# EAGLE design usb-hub-v0.2 (EAGLE 6.4)
CNAME: USB Power hub x4; CREVISION: V0.2; DESIGNER: kennethlimcp
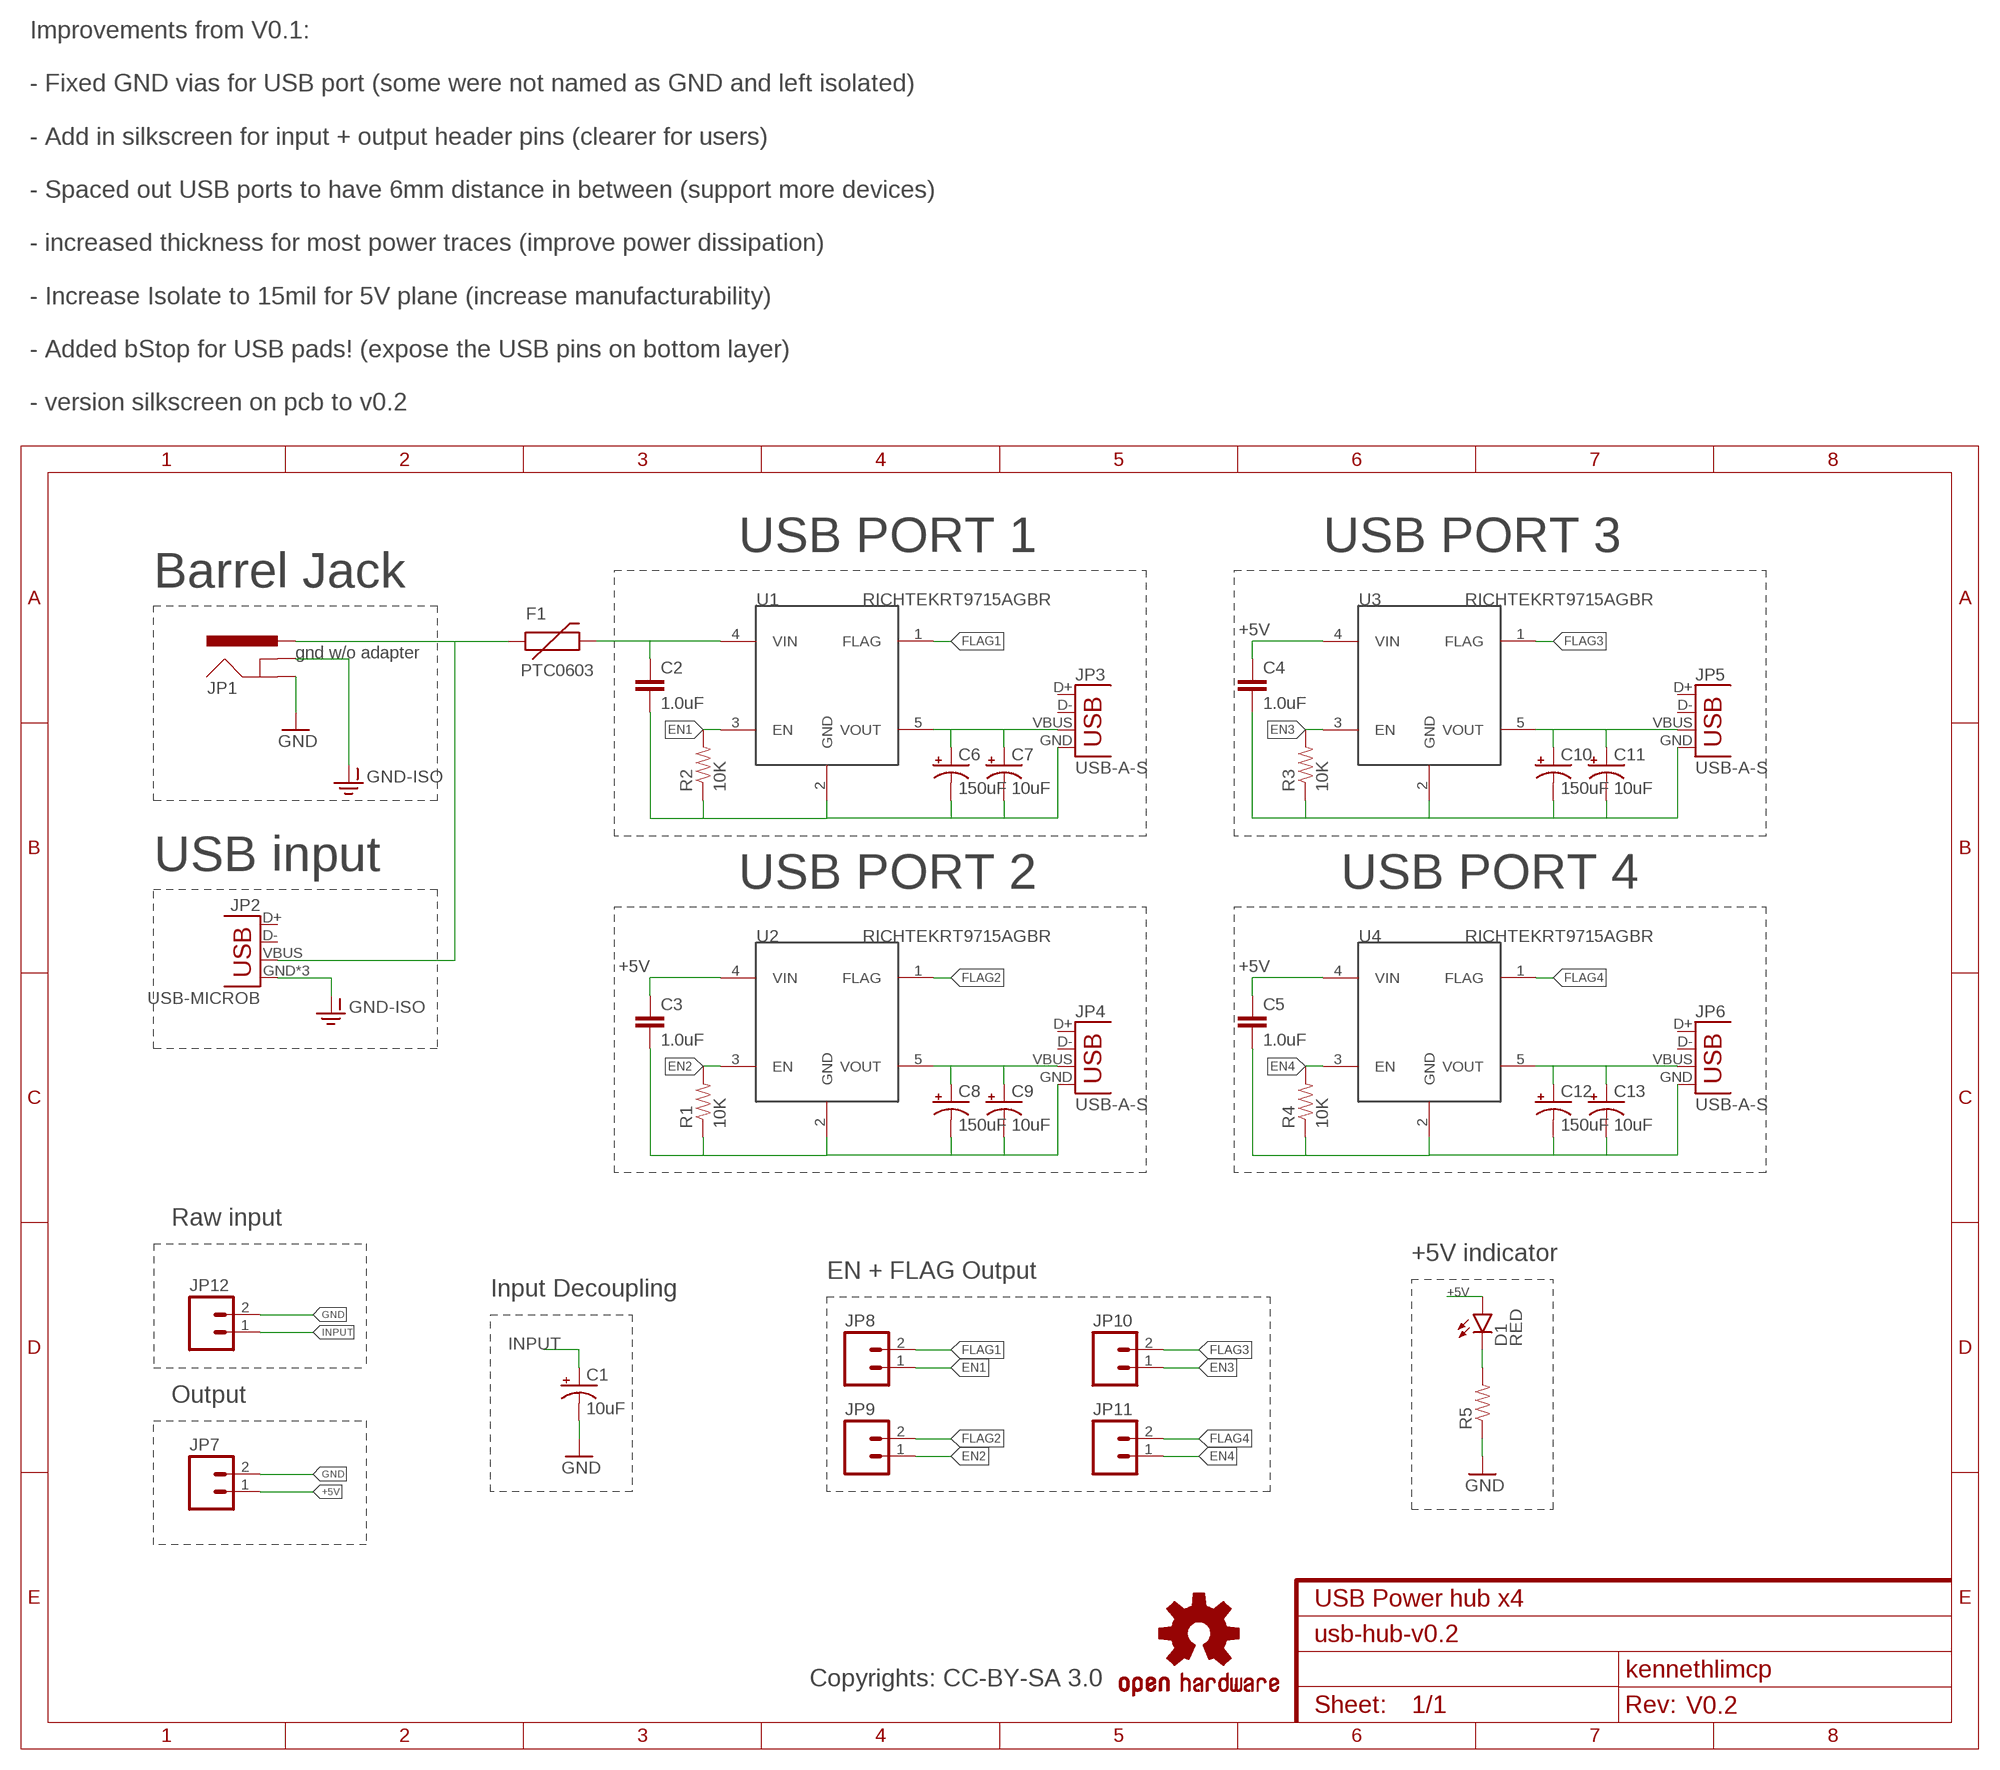
[diagram p0: schematic, sheet 1]

## Parts
C1  10uF  10UF-16V-10%(TANT)  [EIA3216]
C2  1.0uF  1.0UF-16V-10%(0603)  [0603-CAP]
C3  1.0uF  1.0UF-16V-10%(0603)  [0603-CAP]
C4  1.0uF  1.0UF-16V-10%(0603)  [0603-CAP]
C5  1.0uF  1.0UF-16V-10%(0603)  [0603-CAP]
C6  150uF  CAP_POLD  [PANASONIC_D]
C7  10uF  10UF-16V-10%(TANT)  [EIA3216]
C8  150uF  CAP_POLD  [PANASONIC_D]
C9  10uF  10UF-16V-10%(TANT)  [EIA3216]
C10  150uF  CAP_POLD  [PANASONIC_D]
C11  10uF  10UF-16V-10%(TANT)  [EIA3216]
C12  150uF  CAP_POLD  [PANASONIC_D]
C13  10uF  10UF-16V-10%(TANT)  [EIA3216]
D1  RED  LED-RED0603  [LED-0603]
F1  PTC0603  [0603]
JP1  POWER_JACKPTH_LOCK  [POWER_JACK_PTH_LOCK]
JP2  USB-MICROB  [USB-MICROB]
JP3  USB-A-S  [USB-A-S]
JP4  USB-A-S  [USB-A-S]
JP5  USB-A-S  [USB-A-S]
JP6  USB-A-S  [USB-A-S]
JP7  M02PTH  [1X02]
JP8  M02PTH  [1X02]
JP9  M02PTH  [1X02]
JP10  M02PTH  [1X02]
JP11  M02PTH  [1X02]
JP12  M02PTH  [1X02]
LOGO1  OSHW-LOGOPAD  [OSHW-LOGO-M-PAD]
R1  10K  RESISTOR0402  [0402-RES]
R2  10K  RESISTOR0402  [0402-RES]
R3  10K  RESISTOR0402  [0402-RES]
R4  10K  RESISTOR0402  [0402-RES]
R5  RESISTOR0402  [0402-RES]
U1  RICHTEKRT9715AGBR  [SOT23-5]
U2  RICHTEKRT9715AGBR  [SOT23-5]
U3  RICHTEKRT9715AGBR  [SOT23-5]
U4  RICHTEKRT9715AGBR  [SOT23-5]

## Nets
+5V: C2.1 C3.1 C4.1 C5.1 D1.A F1.2 JP7.1 U1.4(VIN) U2.4(VIN) U3.4(VIN) U4.4(VIN)
EN1: JP8.1 R2.2 U1.3(EN)
EN2: JP9.1 R1.2 U2.3(EN)
EN3: JP10.1 R3.2 U3.3(EN)
EN4: JP11.1 R4.2 U4.3(EN)
FLAG1: JP8.2 U1.1(FLAG)
FLAG2: JP9.2 U2.1(FLAG)
FLAG3: JP10.2 U3.1(FLAG)
FLAG4: JP11.2 U4.1(FLAG)
GND: C1.C(-) C2.2 C3.2 C4.2 C5.2 C6.- C7.C(-) C8.- C9.C(-) C10.- C11.C(-) C12.- C13.C(-) JP1.GND JP3.GND JP4.GND JP5.GND JP6.GND JP7.2 JP12.2 R1.1 R2.1 R3.1 R4.1 R5.1 U1.2(GND) U2.2(GND) U3.2(GND) U4.2(GND)
GND-ISO: JP1.GNDBREAK JP2.GND JP2.MT1(GND) JP2.MT2(GND)
INPUT: C1.A(+) F1.1 JP1.PWR JP2.VBUS JP12.1
N$5: D1.C R5.2
VOUT1: C6.+ C7.A(+) JP3.VBUS U1.5(VOUT)
VOUT2: C8.+ C9.A(+) JP4.VBUS U2.5(VOUT)
VOUT3: C10.+ C11.A(+) JP5.VBUS U3.5(VOUT)
VOUT4: C12.+ C13.A(+) JP6.VBUS U4.5(VOUT)
Unconnected: JP2.D+ JP2.D- JP3.D+ JP3.D- JP4.D+ JP4.D- JP5.D+ JP5.D- JP6.D+ JP6.D-

## Notes on the sheet
- Improvements from V0.1:
  
  - Fixed GND vias for USB port (some were not named as GND and left isolated)
  
  - Add in silkscreen for input + output header pins (clearer for users)
  
  - Spaced out USB ports to have 6mm distance in between (support more devices)
  
  - increased thickness for most power traces (improve power dissipation)
  
  - Increase Isolate to 15mil for 5V plane (increase manufacturability)
  
  - Added bStop for USB pads! (expose the USB pins on bottom layer)
  
  - version silkscreen on pcb to v0.2
- USB PORT 1 | USB PORT 3
- Barrel Jack
- gnd w/o adapter
- USB input
- USB PORT 2 | USB PORT 4
- Raw input
- +5V indicator
- EN + FLAG Output
- Input Decoupling
- Output
- Copyrights: CC-BY-SA 3.0

## Library data of the parts
C1 C7 C9 C11 C13 = SparkFun-Capacitors:10UF-16V-10%(TANT): CAP-00811 1206/EIA-3216 Tantalum capacitor; PROD_ID: CAP-00811
C2-C5 = SparkFun-Capacitors:1.0UF-16V-10%(0603): CAP-00868; PROD_ID: CAP-00868
C6 C8 C10 C12 = SparkFun-Capacitors:CAP_POL: Capacitor Polarized These are standard SMD and PTH capacitors. Normally 10uF, 47uF, and 100uF in electrolytic and tantalum varieties. Always verify the external diameter of the through hole cap, it varies with capacity, voltage, and manufacturer. The EIA devices should be standard.
D1 = SparkFun-LED:LED-RED: Assorted Red LEDs LilyPad 1206- DIO-09912 1206- DIO-00809 0603- DIO-00819; PROD_ID: DIO-00819
F1 = SparkFun-PowerIC:PTC: Resettable Fuse PTC Resettable Fuse. Spark Fun Electronics SKU : COM-08357
JP1 = SparkFun-Connectors:POWER_JACK: Power Jack This is the standard 5.5mm barrel jack for power. The PTH is the most common, proven, reliable, footprint. The Slot footprint only works if the mill layer is transmitted to the PCB fab house so be warned. Mating wall wart : TOL-00298 (and others); PROD_ID: CONN-08197; SF_ID: PRT-00119
JP2 = SparkFun-Connectors:USB: USB Connectors USB-B-PTH is fully proven SKU : PRT-00139/CONN-08278 USB-miniB is fully proven SKU : PRT-00587 USB-A-PCB is untested. USB-A-H is throughly reviewed, but untested. Spark Fun Electronics SKU : PRT-00437 USB-B-SMT is throughly reviewed, but untested. Needs silkscreen touching up. USB-A-S has not been used/tested USB-MB-H has not been used/tested USB-MICROB has been used. CONN-09505; PROD_ID: CONN-09505
JP3-JP6 = SparkFun-Connectors:USB: USB Connectors USB-B-PTH is fully proven SKU : PRT-00139/CONN-08278 USB-miniB is fully proven SKU : PRT-00587 USB-A-PCB is untested. USB-A-H is throughly reviewed, but untested. Spark Fun Electronics SKU : PRT-00437 USB-B-SMT is throughly reviewed, but untested. Needs silkscreen touching up. USB-A-S has not been used/tested USB-MB-H has not been used/tested USB-MICROB has been used. CONN-09505
JP7-JP12 = SparkFun-Connectors:M02: Standard 2-pin 0.1" header. Use with - straight break away headers ( PRT-00116) - right angle break away headers (PRT-00553) - swiss pins (PRT-00743) - machine pins (PRT-00117) - female headers (PRT-00115) Molex polarized connector foot print use with: PRT-08233 with associated crimp pins and housings. 2.54_SCREWTERM for use with PRT-10571. 3.5mm Screw Terminal footprints for PRT-08084 5mm Screw Terminal footprints for use with PRT-08432
LOGO1 = kennethlimcp:OSHW-LOGO: Open Source Hardware Logo This logo indicates the piece of hardware it is found on incorporates a OSHW license and/or adheres to the definition of open source hardware found here: http://freedomdefined.org/OSHW
R1-R5 = SparkFun-Resistors:RESISTOR: Resistor Basic schematic elements and footprints for 0603, 1206, and PTH resistors.
U1-U4 = kennethlimcp:RICHTEK: High-Side Power Switches

## Board
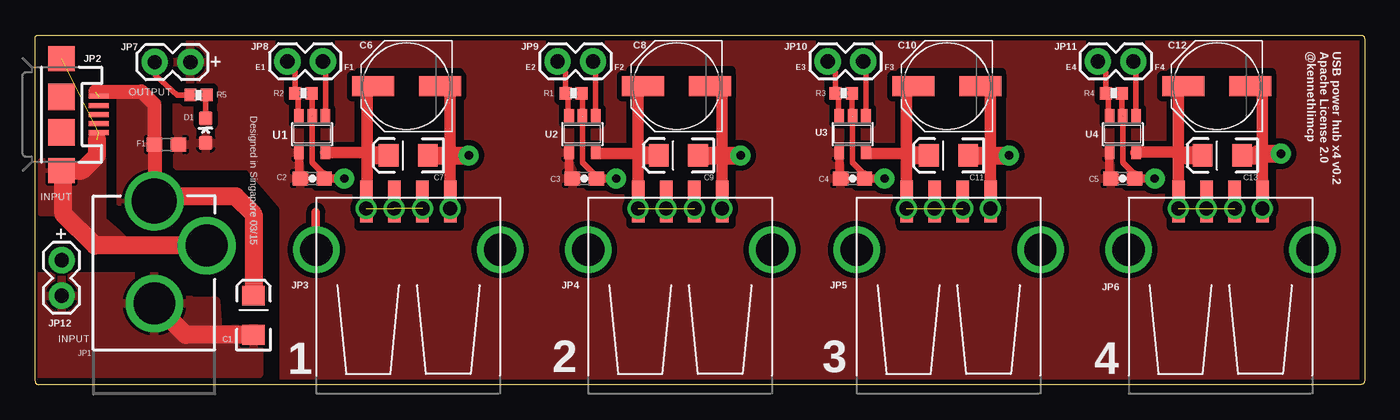
[diagram p1: board, top side]
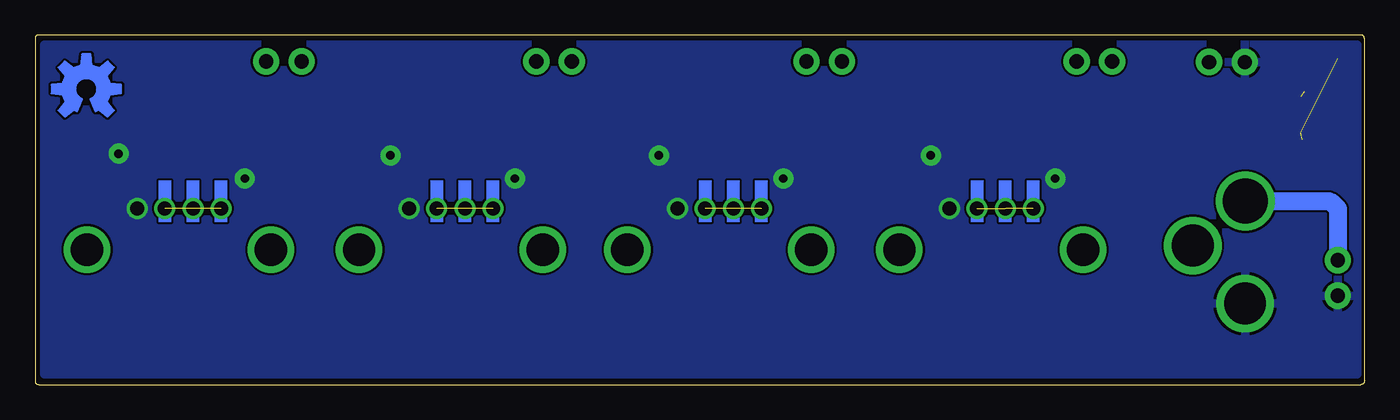
[diagram p2: board, bottom side, seen from below]

Size 95 x 25 mm. Coordinates in mm from the lower left corner, seen from the top.
Outline: 0,0.25 0,24.75 arc-90 0.25,25 94.75,25 arc-90 95,24.75 95,0.25 arc-90 94.75,0 0.25,0 arc-90 0,0.25
Copper layers (1+2*15+16): Top 0.018mm / dielectric 0.195mm / Route2 0.035mm / dielectric 1.1mm / Route15 0.035mm / dielectric 0.195mm / Bottom 0.018mm
Design rules "spark-4layer": minimum track width 6mil, minimum drill 0.3mm, track to track 6mil, track to pad 6mil, pad to pad 6mil, via to via 6mil, smd to smd 6mil, copper to edge 6mil, drill to drill 6mil, minimum pad ring 12mil, minimum via ring 8mil, stop-mask expansion 4mil, vias tented up to drill 20mil, thermal gap 8mil

### Footprints (pad centres in the part's own frame; a part is rotated, then mirrored left to right if it is on the bottom)
EIA3216 = smd 1.4 x 1.6: A 1.4,0; C -1.4,0
0603-CAP = smd 1.1 x 1: 1 -0.85,0; 2 0.85,0
PANASONIC_D = smd 3 x 1.4: + 2.4,0; - -2.4,0
LED-0603 = smd 1 x 1: A 0,-0.877; C 0,0.877
0603 = smd 1.1 x 1: 1 -0.85,0; 2 0.85,0
POWER_JACK_PTH_LOCK = drill 2.997 pad 4.115: GND 0.025,6.557; GNDBREAK 3.762,10.7 | drill 3.2 pad 4.115: PWR 0,13.878
USB-MICROB = smd 0.35 x 1.4: D+ 0,2.65; D- -0.65,2.65; GND 1.3,2.65; ID 0.65,2.65; VBUS -1.3,2.65 | smd 1.8 x 1.9: MT1 -4,0; MT2 4,0 | smd 1.9 x 1.9: P$1 -1.27,0; P$2 1.27,0
USB-A-S = smd 3 x 0.9: D+ 3.45,-1; D- 3.45,1; GND 3.45,-3; VBUS 3.45,3 | drill 2.311: P$5 0,-6.566; P$6 0,6.566
1X02 = drill 1.016 pad 1.88: 1 0,0; 2 2.54,0
0402-RES = smd 0.85 x 0.9: 1 -0.58,0; 2 0.58,0
SOT23-5 = smd 0.69 x 0.99: 1 -0.95,-1.29; 2 0,-1.29; 3 0.95,-1.29; 4 0.95,1.3; 5 -0.95,1.3

### Placement (x,y rotation side)
C1  15.62,4.95 90 top
C2  19.81,14.73 0 top
C3  39.24,14.73 0 top
C4  58.42,14.73 0 top
C5  77.72,14.73 0 top
C6  26.54,21.34 180 top
C7  26.67,16.38 180 top
C8  45.85,21.34 180 top
C9  45.97,16.38 180 top
C10  65.15,21.34 180 top
C11  65.28,16.38 180 top
C12  84.45,21.34 180 top
C13  84.84,16.38 180 top
D1  12.19,18.16 0 top
F1  9.4,17.14 0 top
JP1  8.51,-0.76 0 top
JP2  1.91,19.3 270 top
JP3  26.67,9.65 90 top
JP4  46.1,9.65 90 top
JP5  65.28,9.65 90 top
JP6  84.71,9.65 90 top
JP7  11.1,23.06 180 top
JP8  18.03,23.11 0 top
JP9  37.34,23.11 0 top
JP10  56.64,23.11 0 top
JP11  75.95,23.11 0 top
JP12  1.91,8.89 270 top
LOGO1  91.34,21.14 0 bottom
R1  38.48,20.83 180 top
R2  19.18,20.83 180 top
R3  57.78,20.83 180 top
R4  77.09,20.83 180 top
R5  11.68,20.7 0 top
U1  19.81,17.91 180 top
U2  39.12,17.91 180 top
U3  58.42,17.91 180 top
U4  77.72,17.91 180 top

### Tracks (layer width: path | path; a pad name or v marks a point on that pad's centre or on a via)
+5V
  Top 0.61: C2.1 18.86,14.99 U1.4 | C4.1 57.47,14.83 U3.4 | C5.1 76.77,14.83 U4.4 | C3.1 38.17,14.96 U2.4
  pour Top (isolate 0.381): 94.57,0.51 94.8,24.77 10.08,24.79 10.16,15.62 15.37,15.62 15.37,15.49 17.78,12.7 17.78,0.38
EN1
  Top 0.406: U1.3 18.8,19.26 18.8,20.83 R2.2 18.6,22.35 JP8.1
EN2
  Top 0.406: U2.3 38.1,19.26 38.1,20.76 R1.2 37.9,22.3 JP9.1
EN3
  Top 0.406: U3.3 57.4,19.26 57.4,20.38 R3.2 57.2,22.3 JP10.1
EN4
  Top 0.406: U4.3 76.71,19.26 76.71,20.38 R4.2 76.51,22.3 JP11.1
FLAG1
  Top 0.406: U1.1 20.76,22.79 JP8.2
FLAG2
  Top 0.406: U2.1 40.07,22.79 JP9.2
FLAG3
  Top 0.406: U3.1 59.37,22.79 JP10.2
FLAG4
  Top 0.406: U4.1 78.67,22.93 JP11.2
GND  (via drill 0.6 pad 1.42, 1 pad 0.6)
  Top 0.406: 40.09,14.9 39.12,15.88 U2.2 39.12,20.9 R1.1 | 78.57,15.03 77.72,15.88 U4.2 77.67,19.25 R4.1 | 59.27,15.03 58.42,15.88 U3.2 58.37,19.25 R3.1 | 20.66,15.03 19.81,15.88 U1.2 19.81,20.52 R2.1 | 87.25,16.38 87.58,16.38 arc-90 87.71,16.26 | 67.82,16.38 68.02,16.38 arc-90 68.28,16.13 | R5.1 10.16,20.7 8.64,22.1 8.64,22.99 JP7.2 | 68.07,21.34 C10.- | 87.63,21.34 C12.- | 49.02,21.34 C8.-
  Top 0.61: C6.- 29.67,21.34 | 29.21,16.38 29.72,16.38 29.72,13.15 JP3.GND | 49.1,21.26 49.02,21.34 | C3.2 40.09,14.9 40.26,14.73 v41.53,14.73 | 87.63,21.34 87.71,21.26 | C5.2 78.57,15.03 78.87,14.73 v80.01,14.73 | 68.28,21.13 68.07,21.34 | C4.2 59.27,15.03 59.44,14.73 v60.71,14.73 | 20.66,15.03 C2.2 v22.1,14.73 | 48.64,16.38 49.02,16.38 49.02,13.31 JP4.GND | 87.25,16.38 87.38,16.51 | JP6.GND 87.76,13.28 87.71,14.12 | JP5.GND 68.33,13.28
  Top 0.813: 29.67,21.34 JP3.GND | JP4.GND 49.1,21.26 | JP5.GND 68.28,16.13 68.28,21.13 | 87.71,21.26 87.71,16.26 87.71,14.12
  Top 1.27: C1.C 10.78,3.55 JP1.GND | C7.C 29.21,16.38 | 29.72,16.38 v30.99,16.38 | C9.C 48.64,16.38 | C13.C 87.25,16.38 | C11.C 67.82,16.38 v69.6,16.38 | 49.02,16.38 v50.42,16.38 | 87.38,16.51 v89.03,16.51
  other vias: 29.67,12.6 49.1,12.6 68.28,12.6 87.71,12.6
  pour Bottom: 0.51,24.29 94.33,24.29 94.33,0.73 0.51,0.73
  pour Top: 0.25,7.75 9.65,7.75 11.18,5.97 12.95,5.97 13.08,3.94 16,4.06 16,0.76 0.25,0.76
GND-ISO  (2 unrouted)
  Top 1.016: 2.03,15.18 JP2.MT2
  Top 1.27: JP1.GNDBREAK 4.29,9.94 2.03,12.19 2.03,15.18 | JP2.MT2 3.37,15.3 4.45,16.38 4.45,17.53
  pour Top: 12.45,9.53 12.45,10.29 12.32,10.41 6.48,10.41 5.97,10.92 4.95,11.81 4.95,16.13 3.68,16.13 3.17,15.62 2.79,16 0.38,16 0.38,12.19 1.4,12.19 4.06,9.53
INPUT  (1 unrouted)
  Top 0.406: 8.51,17.11 F1.1
  Top 1.016: F1.1 8.55,13.15 JP1.PWR | 4.32,20.95 7.62,20.95 8.51,20.07 8.51,17.11
  Top 1.27: JP1.PWR 8.86,13.46 14.35,13.46 15.62,12.19 C1.A
  Bottom 1.016: 2.55,13.12 arc45 2.37,13.04
  Bottom 1.27: JP1.PWR 2.55,13.12 | 2.37,13.04 1.91,12.57 JP12.1
  pour Top: 5.97,21.21 5.97,12.95 8.89,12.95 8.89,20.19 7.75,21.21
N$1
  cutout Top (no thermals): 42.55,22.48 49.78,22.48 49.78,11.43 42.55,11.43
  cutout Top (no thermals): 23.11,22.35 30.35,22.35 30.35,11.3 23.11,11.3
  cutout Top (no thermals): 61.85,22.35 69.09,22.35 69.09,11.3 61.85,11.3
  cutout Top (no thermals): 81.15,22.35 88.39,22.35 88.39,11.3 81.15,11.3
N$2  (via drill 1 pad 0.6)  (2 unrouted)
  other vias: 81.71,12.6 83.69,12.6 85.72,12.6
N$3  (via drill 1 pad 0.6)  (2 unrouted)
  other vias: 43.1,12.6 45.09,12.6 47.12,12.6
N$4  (via drill 1 pad 0.6)  (2 unrouted)
  other vias: 62.28,12.6 64.26,12.6 66.29,12.6
N$5
  Top 0.406: D1.C 12.19,20.5 R5.2
N$6  (via drill 1 pad 0.6)  (2 unrouted)
  other vias: 23.67,12.6 25.65,12.6 27.69,12.6
N$10
  Top 0.61: 20.07,9.65 20.07,12.35
VOUT1
  Top 0.61: JP3.VBUS 23.75,13.61 | C6.+ 23.75,21.34 | 23.75,16.61 23.97,16.38 24.26,16.38
  Top 0.813: 23.75,13.61 23.75,16.61 | 23.75,21.34 23.75,16.61 | U1.5 23.75,16.61
  Top 1.27: C7.A 24.26,16.38
VOUT2
  Top 0.61: 43.1,20.99 C8.+ | U2.5 40.16,16.51 | 43.1,16.51 43.23,16.38 43.56,16.38
  Top 0.813: JP4.VBUS 43.1,16.51 | 43.1,16.51 43.1,20.99 | 40.16,16.51 43.1,16.51
  Top 1.27: C9.A 43.56,16.38
VOUT3
  Top 0.61: 62.28,20.86 C10.+ | U3.5 59.59,16.51 | C11.A 62.23,16.51 62.23,13.28 JP5.VBUS
  Top 0.813: JP5.VBUS 62.28,20.86 | 59.59,16.51 62.23,16.51
  Top 1.27: C11.A 62.74,16.38
VOUT4
  Top 0.61: 81.71,20.99 C12.+ | 82.3,16.38 81.71,15.8
  Top 0.813: 81.71,20.99 81.71,15.8 JP6.VBUS | 82.3,16.38 81.79,16.38 81.79,16.64 79.06,16.64 U4.5
  Top 1.27: C13.A 82.3,16.38
(copper drawn outside any net)
  shapes: Bottom area x12

### Text on the board
tNames: USB power hub x4 v0.2 / Apache License 2.0 / @kennethlimcp | + | E1 | F1 | E2 | F2 | E3 | F3 | E4 | F4 | OUTPUT | Designed in Singapore 03/15 | INPUT | + | INPUT | 1 | 2 | 3 | 4